# Altium schematic sheet Sheet1.SchDoc
size A4
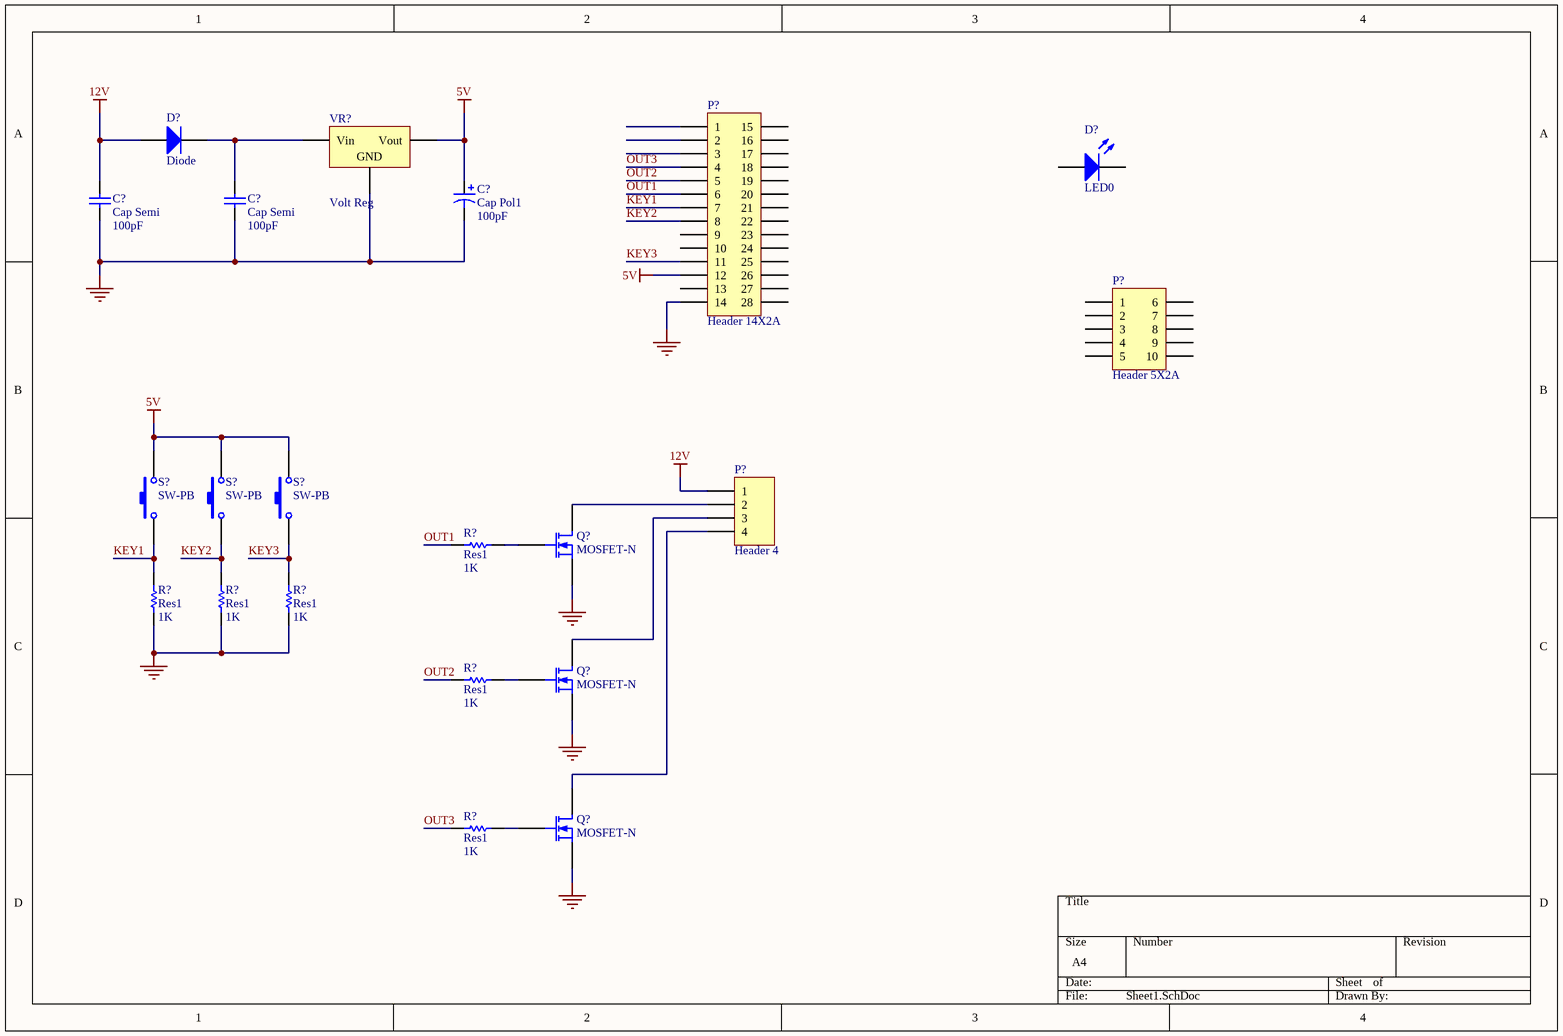
[diagram p0: Sheet1.SchDoc]

## Parts
(Parts that share a designator on the sheet are numbered #1, #2 ... from top to bottom, then left to right.)
C?#1  Cap Semi  value 100pF  [C1206]
C?#2  Cap Semi  value 100pF  [C1206]
C?#3  Cap Pol1  value 100pF  [RB7.6-15]
D?#1  Diode  [SMC]
D?#2  LED0  [LED-0]
P?#1  Header 14X2A  [HDR2X14_CEN]
P?#2  Header 5X2A  [HDR2X5_CEN]
P?#3  Header 4  [HDR1X4]
Q?#1  MOSFET-N  [E3]
Q?#2  MOSFET-N  [E3]
Q?#3  MOSFET-N  [E3]
R?#1  Res1  value 1K  [AXIAL-0.3]
R?#2  Res1  value 1K  [AXIAL-0.3]
R?#3  Res1  value 1K  [AXIAL-0.3]
R?#4  Res1  value 1K  [AXIAL-0.3]
R?#5  Res1  value 1K  [AXIAL-0.3]
R?#6  Res1  value 1K  [AXIAL-0.3]
S?#1  SW-PB  [SPST-2]
S?#2  SW-PB  [SPST-2]
S?#3  SW-PB  [SPST-2]
VR?  Volt Reg  [D2PAK_N]

## Nets
5V: C?#3.1 P?#1.12 S?#1.2 S?#2.2 S?#3.2 VR?.3(Vout)
12V: C?#1.1 D?#1.1(A) P?#3.1
GND: C?#1.2 C?#2.2 C?#3.2 P?#1.14 Q?#1.3(S) Q?#2.3(S) Q?#3.3(S) R?#2.1 R?#3.1 R?#4.1 VR?.2(GND)
KEY1: P?#1.7 R?#2.2 S?#1.1
KEY2: P?#1.8 R?#3.2 S?#2.1
KEY3: P?#1.11 R?#4.2 S?#3.1
OUT1: P?#1.6 R?#1.2
OUT2: P?#1.5 R?#5.2
OUT3: P?#1.4 R?#6.2
NetC?#2_1: C?#2.1 D?#1.2(K) VR?.1(Vin)
NetP?#3_2: P?#3.2 Q?#1.1(D)
NetP?#3_3: P?#3.3 Q?#2.1(D)
NetP?#3_4: P?#3.4 Q?#3.1(D)
NetQ?#1_2: Q?#1.2(G) R?#1.1
NetQ?#2_2: Q?#2.2(G) R?#5.1
NetQ?#3_2: Q?#3.2(G) R?#6.1

Not connected (* = marked no-connect by the designer): D?#2 1(A) 2(K); P?#1 1 2 3 9 10 13 15 16 17 18 19 20 21 22 23 24 25 26 27 28; P?#2 1 2 3 4 5 6 7 8 9 10

## Library data of the parts
C?#1 C?#2 = Cap Semi: Capacitor (Semiconductor SIM Model); Published: 8-Jun-2000; LatestRevisionDate: 29-May-2009; LatestRevisionNote: IPC-7351 Footprint Added.; PackageReference: C1206; Publisher: Altium Limited; PackageDescription: Chip Capacitor
C?#3 = Cap Pol1: Polarized Capacitor (Radial); Published: 8-Jun-2000; LatestRevisionDate: 17-Jul-2002; LatestRevisionNote: Re-released for DXP Platform.; PackageReference: RB7.6-15; Publisher: Altium Limited; PackageDescription: Polarized Capacitor (Radial); 2 Leads
D?#1 = Diode: Default Diode; Published: 8-Jun-2000; LatestRevisionDate: 17-Jul-2002; LatestRevisionNote: Re-released for DXP Platform.; PackageVersion: Sep-1996; PackageReference: SMC; Publisher: Altium Limited; PackageDescription: DO-214-AB/SMC; 2 C-Bend Leads; Body 7.9 x 5.9 mm, inc. leads (LxW); Code_JEDEC: DO-214-AB
D?#2 = LED0: Typical INFRARED GaAs LED; Published: 8-Jun-2000; LatestRevisionDate: 08-Jul-2005; LatestRevisionNote: Mech Layer 1 removed.; PackageReference: LED-0; Publisher: Altium Limited; PackageDescription: LED; 2 Leads
P?#1 = Header 14X2A: Header, 14-Pin, Dual row; LatestRevisionDate: 17-Jul-2002; LatestRevisionNote: Re-released for DXP Platform.; Publisher: Altium Limited
P?#2 = Header 5X2A: Header, 5-Pin, Dual row; LatestRevisionDate: 17-Jul-2002; LatestRevisionNote: Re-released for DXP Platform.; Publisher: Altium Limited
P?#3 = Header 4: Header, 4-Pin; LatestRevisionDate: 17-Jul-2002; LatestRevisionNote: Re-released for DXP Platform.; Publisher: Altium Limited
Q?#1-Q?#3 = MOSFET-N: N-Channel MOSFET; Published: 8-Jun-2000; LatestRevisionDate: 17-Jul-2002; LatestRevisionNote: Re-released for DXP Platform.; PackageVersion: 1995/1996; PackageReference: E3; Publisher: Altium Limited; PackageDescription: TO, Flat Index; 3 In-Line, Axial Leads; Body Dia. 4.6mm; Lead Dia. 0.5 mm (max)
R?#1-R?#6 = Res1: Resistor; Published: 8-Jun-2000; LatestRevisionDate: 17-Jul-2002; LatestRevisionNote: Re-released for DXP Platform.; PackageReference: AXIAL-0.3; Publisher: Altium Limited; PackageDescription: Axial Device, Thru-Hole; 2 Leads; 0.3 in Pin Spacing
S?#1-S?#3 = SW-PB: Switch; Published: 24-Mar-1999; LatestRevisionDate: 17-Jul-2002; LatestRevisionNote: Re-released for DXP Platform.; PackageReference: SPST-2; Publisher: Altium Limited; PackageDescription: Switch; 2 Leads
VR? = Volt Reg: Voltage Regulator; Published: 24-Mar-1999; LatestRevisionDate: 29-May-2009; LatestRevisionNote: IPC-7351 Footprint Added.; PackageReference: D2PAK; Publisher: Altium Limited; PackageDescription: 3-Pin Transistor Outline Package 2.54 mm Pitch, 15.1 mm Lead Span